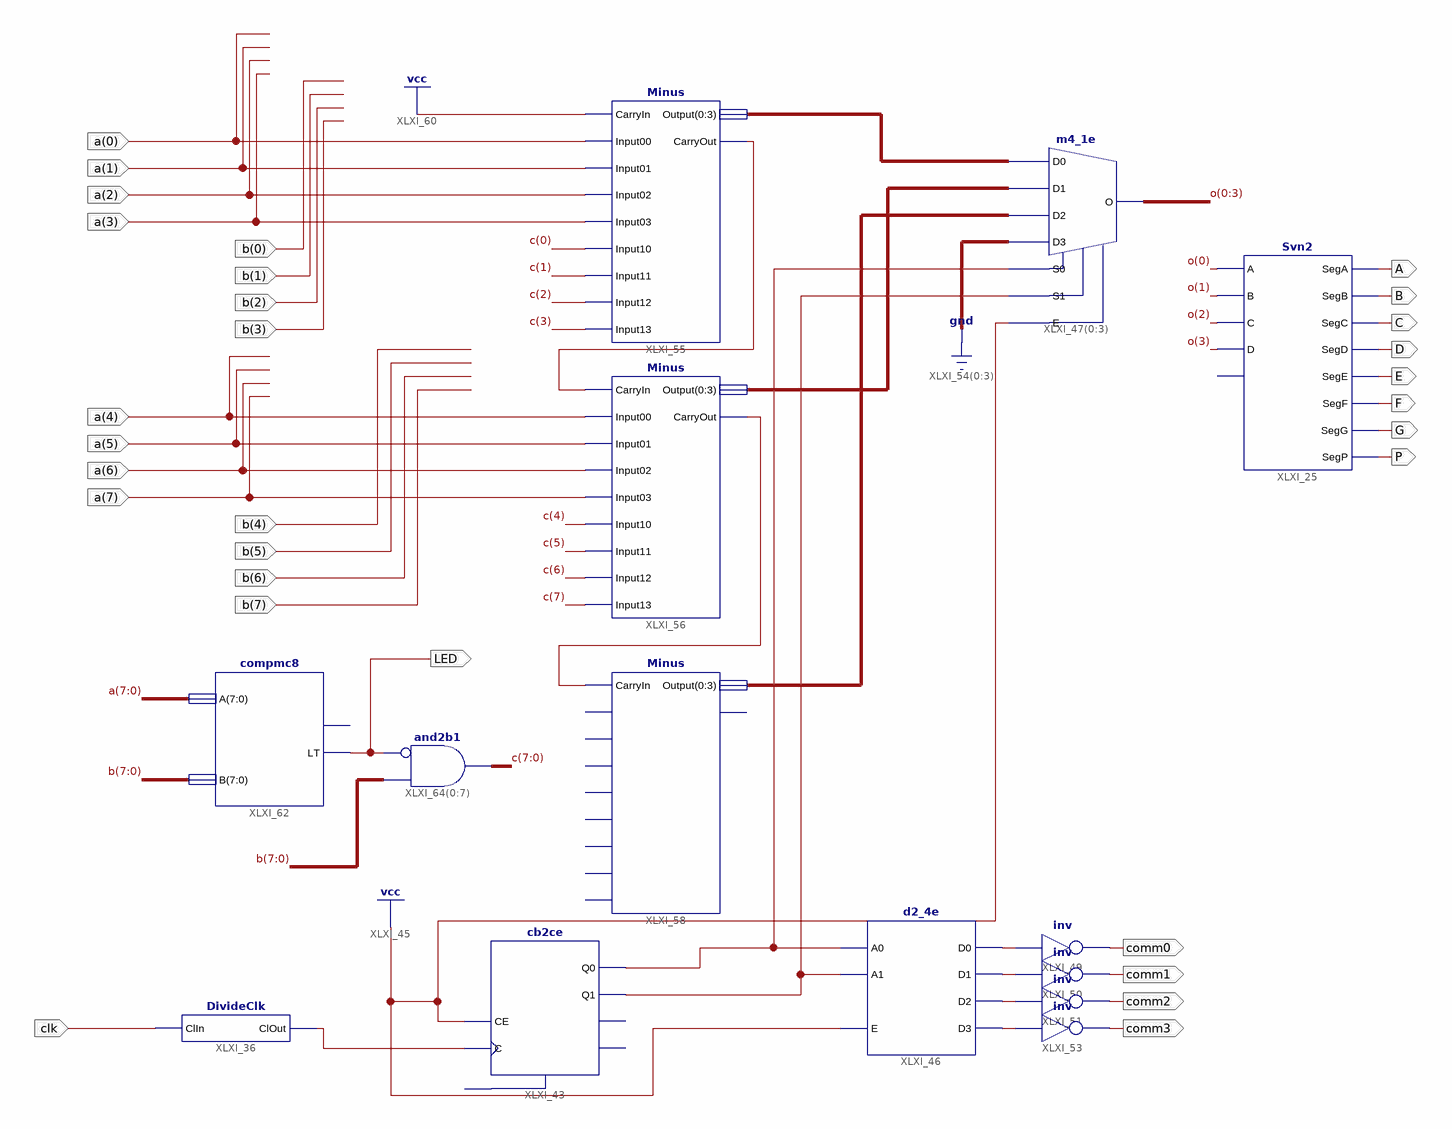
[diagram p0: schematic sheet 1]
// Xilinx ISE schematic res.sch (spartan6) as structural Verilog: 14 symbols, 30 ports
module res (
  input  [7:0] a,
  input  [7:0] b,
  input  clk,
  output a_1bit,
  output b_1bit,
  output C,
  output D,
  output E,
  output F,
  output G,
  output P,
  output comm0,
  output comm1,
  output comm2,
  output comm3,
  output LED
);

  wire com0, XLXN_10, XLXN_81, XLXN_83, XLXN_98, XLXN_103, XLXN_104, XLXN_105, XLXN_106;
  wire [3:0] o, XLXN_12, XLXN_13, XLXN_97;
  wire [7:0] C_bus;

  Svn2 XLXI_25 (
    .A(o[0]), .B(o[1]), .C(o[2]), .D(o[3]), .SegA(a_1bit), .SegB(b_1bit), .SegC(C), .SegD(D), .SegE(E),
    .SegF(F), .SegG(G), .SegP(P));  // open: P
  cb2ce XLXI_43 (.C(com0), .CE(1'b1), .Q0(XLXN_81), .Q1(XLXN_83));  // open: CLR, CEO, TC
  DivideClk XLXI_36 (.ClIn(clk), .ClOut(com0));
  d2_4e XLXI_46 (.A0(XLXN_81), .A1(XLXN_83), .E(1'b1), .D0(XLXN_103), .D1(XLXN_104), .D2(XLXN_105), .D3(XLXN_106));
  m4_1e XLXI_47[0:3] (
    .D0({XLXN_12[0], XLXN_12[1], XLXN_12[2], XLXN_12[3]}),
    .D1({XLXN_13[0], XLXN_13[1], XLXN_13[2], XLXN_13[3]}),
    .D2({XLXN_97[0], XLXN_97[1], XLXN_97[2], XLXN_97[3]}), .D3(4'b0000), .E(1'b1), .S0(XLXN_81),
    .S1(XLXN_83), .O({o[0], o[1], o[2], o[3]}));
  not XLXI_49 (comm0, XLXN_103);
  not XLXI_50 (comm1, XLXN_104);
  not XLXI_51 (comm2, XLXN_105);
  not XLXI_53 (comm3, XLXN_106);
  Minus XLXI_55 (
    .CarryIn(1'b1), .CarryOut(XLXN_10), .Input00(a[0]), .Input01(a[1]), .Input02(a[2]), .Input03(a[3]),
    .Input10(C_bus[0]), .Input11(C_bus[1]), .Input12(C_bus[2]), .Input13(C_bus[3]),
    .Output({XLXN_12[0], XLXN_12[1], XLXN_12[2], XLXN_12[3]}));
  Minus XLXI_56 (
    .CarryIn(XLXN_10), .CarryOut(XLXN_98), .Input00(a[4]), .Input01(a[5]), .Input02(a[6]), .Input03(a[7]),
    .Input10(C_bus[4]), .Input11(C_bus[5]), .Input12(C_bus[6]), .Input13(C_bus[7]),
    .Output({XLXN_13[0], XLXN_13[1], XLXN_13[2], XLXN_13[3]}));
  Minus XLXI_58 (
    .CarryIn(XLXN_98), .Output({XLXN_97[0], XLXN_97[1], XLXN_97[2], XLXN_97[3]}));  // open: CarryOut, Input00, Input01, Input02, Input03, Input10, Input11, Input12, Input13
  compmc8 XLXI_62 (.A(a), .B(b), .LT(LED));  // open: GT
  assign C_bus = ~{8{LED}} & b;  // and2b1 XLXI_64[0..7], 8 bits wide
endmodule
